# Altium schematic sheet eps_bb1.SchDoc
size A4
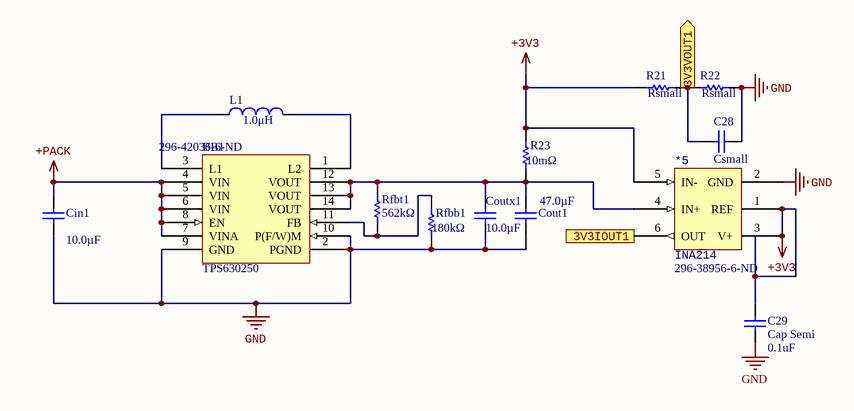
[diagram p0: eps_bb1.SchDoc]

## Parts
*5  INA214  Supplier Part Number 1: 296-38956-6-ND  [SOT65P210X110-6N]
BB1  TPS630250  Supplier Part Number 1: 296-42036-6-ND  [RNC0014A]
C28  value Csmall  [1608[0603]]  (hidden comment: Cap)
C29  Cap Semi  value 0.1uF  [1608[0603]]
Cin1  value 10.0µF  [1608[0603]]  (hidden comment: Cap)
Cout1  value 47.0µF  [1608[0603]]  (hidden comment: Cap)
Coutx1  value 10.0µF  [1608[0603]]  (hidden comment: Cap)
L1  value 1.0μH  [1608[0603]]  (hidden comment: Inductor)
R21  value Rsmall  [1608[0603]]  (hidden comment: Res1)
R22  value Rsmall  [1608[0603]]  (hidden comment: Res1)
R23  value 10mΩ  [1608[0603]]  (hidden comment: Res1)
Rfbb1  value 180kΩ  [1608[0603]]  (hidden comment: Res1)
Rfbt1  value 562kΩ  [1608[0603]]  (hidden comment: Rfbt1)

## Ports
3V3IOUT1 (out), 3V3VOUT1 (out)

## Nets
+3V3: *5.1(REF) *5.3(V+) *5.5(IN-) C29.2 R21.1 R23.2
+PACK: BB1.4(VIN) BB1.5(VIN) BB1.6(VIN) BB1.7(VINA) BB1.8(EN) Cin1.2
GND: *5.2(GND) BB1.2(PGND) BB1.9(GND) BB1.10(P(F/W)M) C28.1 C29.1 Cin1.1 Cout1.1 Coutx1.1 R22.2 Rfbb1.1
3V3IOUT1: *5.6(OUT) ; port 3V3IOUT1
3V3VOUT1: C28.2 R21.2 R22.1 ; port 3V3VOUT1
Net*5_4: *5.4(IN+) BB1.12(VOUT) BB1.13(VOUT) BB1.14(VOUT) Cout1.2 Coutx1.2 R23.1 Rfbt1.1
NetBB1_1: BB1.1(L2) L1.2
NetBB1_3: BB1.3(L1) L1.1
NetBB1_11: BB1.11(FB) Rfbb1.2 Rfbt1.2

## Library data of the parts
*5 = INA214: Current monitor; Supplier 1: Digi-Key
BB1 = TPS630250: Buck-boost converter; Supplier 1: Digi-Key
C28 Cin1 Cout1 Coutx1 = Cap: Capacitor; Published: 8-Jun-2000; LatestRevisionDate: 17-Jul-2002; LatestRevisionNote: Re-released for DXP Platform.; PackageReference: RAD-0.3; Publisher: Altium Limited; PackageDescription: Radial Cap, Thru-Hole; 2 Leads; 0.3 in Pin Spacing
C29 = Cap Semi: Capacitor (Semiconductor SIM Model); Published: 8-Jun-2000; LatestRevisionDate: 29-May-2009; LatestRevisionNote: IPC-7351 Footprint Added.; PackageReference: C1206; Publisher: Altium Limited; PackageDescription: Chip Capacitor
L1 = Inductor: Code_IEC: 1005; Published: 8-Jun-2000; LatestRevisionDate: 29-May-2009; LatestRevisionNote: IPC-7351 Footprint Added.; PackageReference: 0402-A; Publisher: Altium Limited; PackageDescription: Chip Inductor; Code_JEITA: 0402
R21-R23 Rfbb1 Rfbt1 = Res1: Resistor; Published: 8-Jun-2000; LatestRevisionDate: 17-Jul-2002; LatestRevisionNote: Re-released for DXP Platform.; PackageReference: AXIAL-0.3; Publisher: Altium Limited; PackageDescription: Axial Device, Thru-Hole; 2 Leads; 0.3 in Pin Spacing